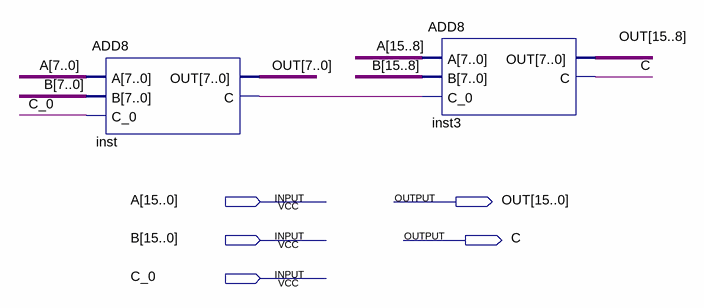
[diagram p0: schematic sheet]
// Quartus schematic ADD16.bdf as structural Verilog: 2 symbols, 5 pins
module ADD16 (
  input  [15:0] A,
  input  [15:0] B,
  input  C_0,
  output [15:0] OUT,
  output C
);

  wire inst_c;

  ADD8 inst (.A(A[7:0]), .B(B[7:0]), .C_0(C_0), .OUT(OUT[7:0]), .C(inst_c));
  ADD8 inst3 (.A(A[15:8]), .B(B[15:8]), .C_0(inst_c), .OUT(OUT[15:8]), .C(C));
endmodule
